# EAGLE design LAN_HUB_imp (EAGLE 6.4)
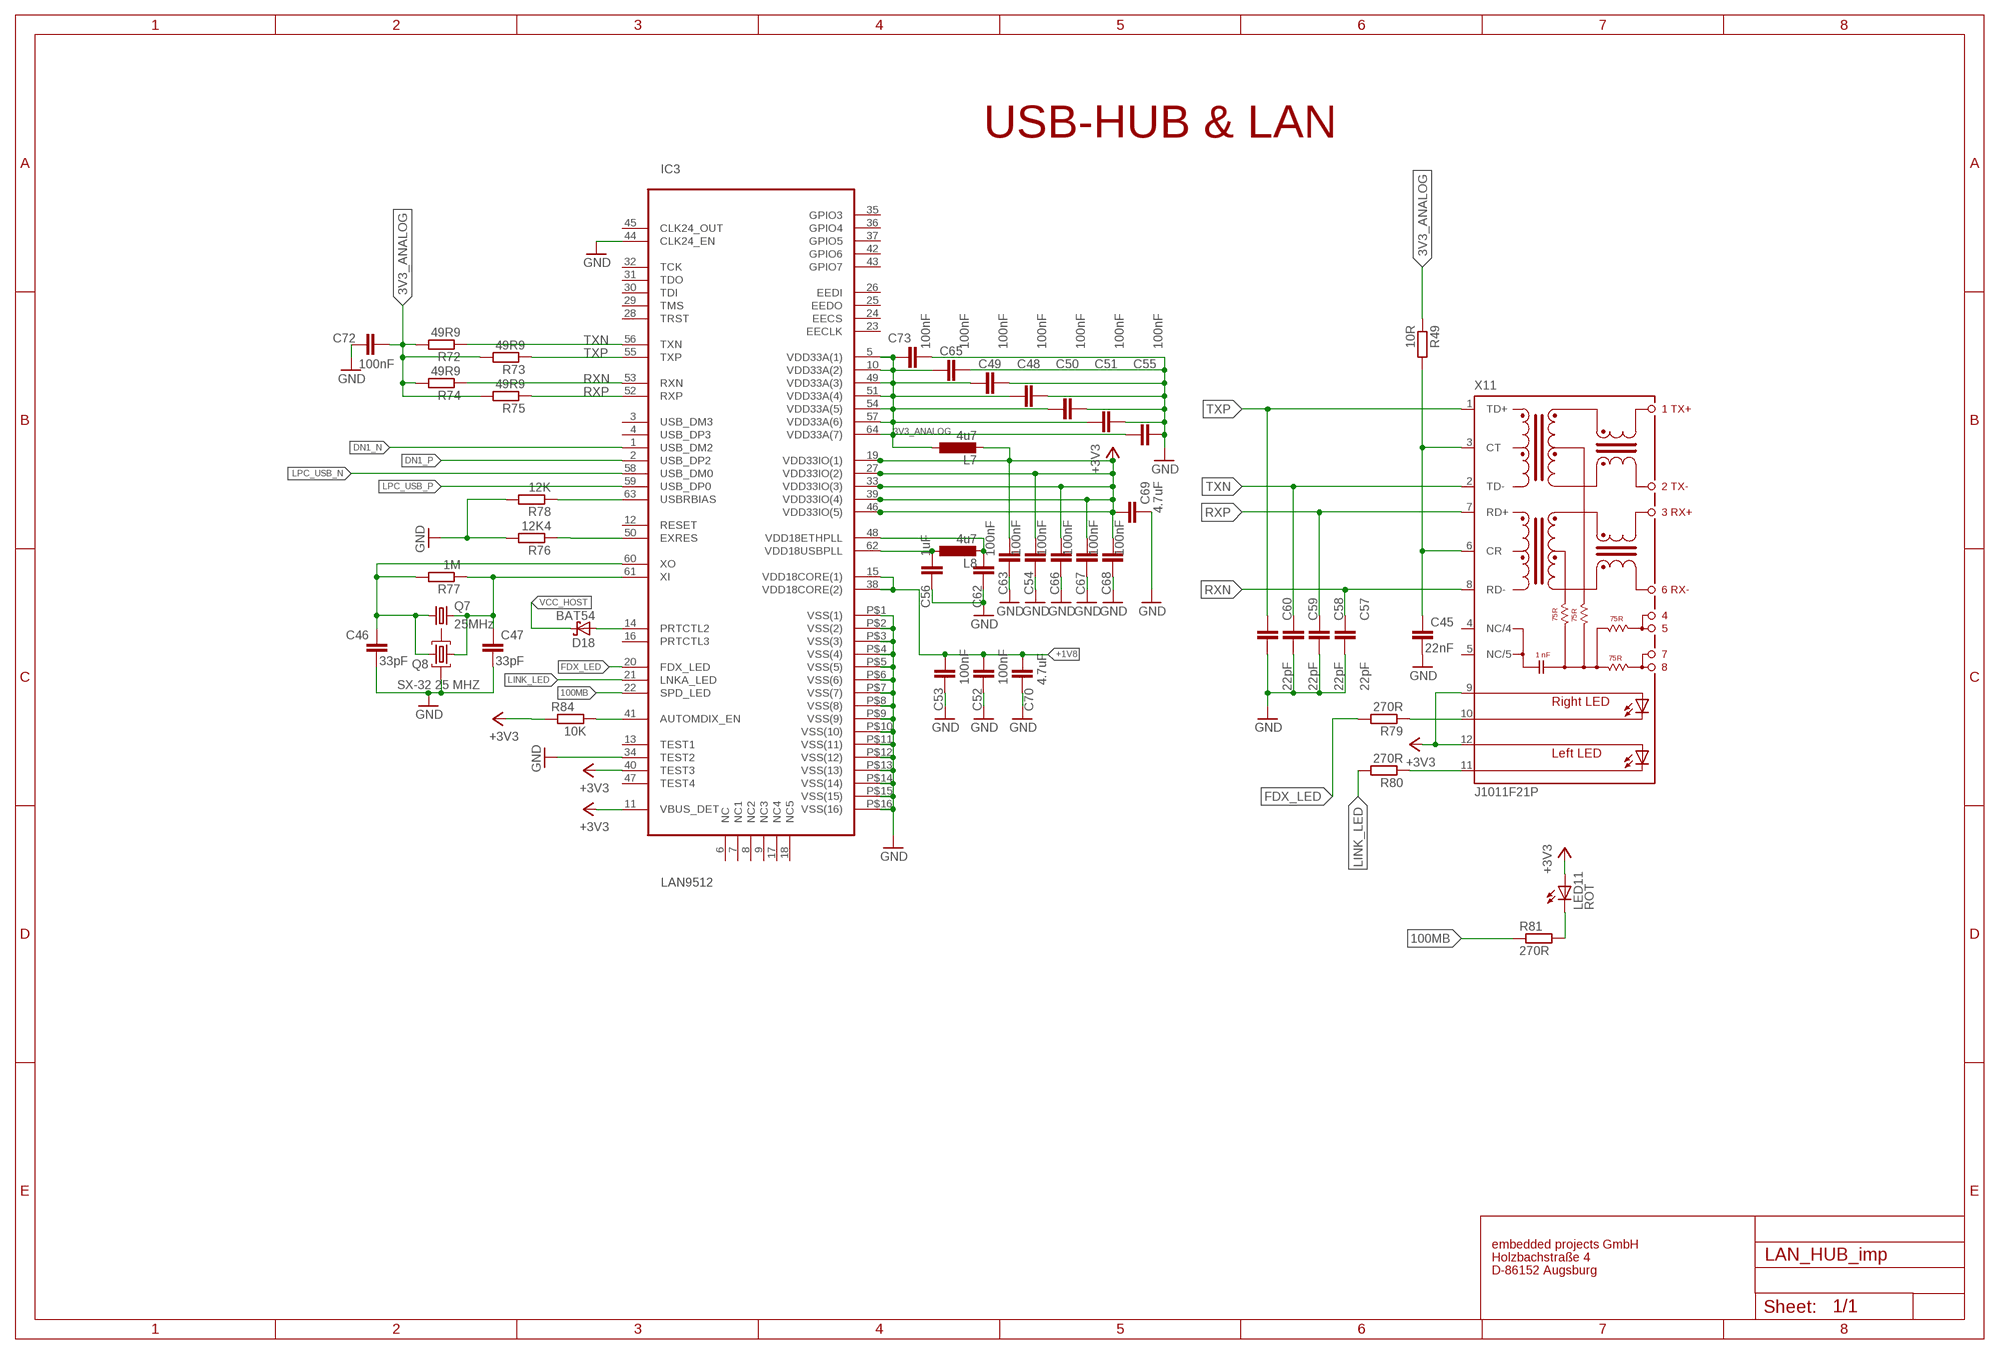
[diagram p0: schematic, sheet 1]

## Parts
C45  22nF  C-EUC0805  [C0805]
C46  33pF  C-EUC0805  [C0805]
C47  33pF  C-EUC0805  [C0805]
C48  100nF  C-EUC0805  [C0805]
C49  100nF  C-EUC0805  [C0805]
C50  100nF  C-EUC0805  [C0805]
C51  100nF  C-EUC0805  [C0805]
C52  100nF  C-EUC0805  [C0805]
C53  100nF  C-EUC0805  [C0805]
C54  100nF  C-EUC0805  [C0805]
C55  100nF  C-EUC0805  [C0805]
C56  1uF  C-EUC0805  [C0805]
C57  22pF  C-EUC0805  [C0805]
C58  22pF  C-EUC0805  [C0805]
C59  22pF  C-EUC0805  [C0805]
C60  22pF  C-EUC0805  [C0805]
C62  100nF  C-EUC0805  [C0805]
C63  100nF  C-EUC0805  [C0805]
C65  100nF  C-EUC0805  [C0805]
C66  100nF  C-EUC0805  [C0805]
C67  100nF  C-EUC0805  [C0805]
C68  100nF  C-EUC0805  [C0805]
C69  4.7uF  C-EUC0805  [C0805]
C70  4.7uF  C-EUC0805  [C0805]
C72  100nF  C-EUC0805  [C0805]
C73  100nF  C-EUC0805  [C0805]
D18  BAT54  DIODE_BAT54  [SOT-23]
IC3  LAN9512  [QFN-64]
L7  4u7  PSU3014  [PSU3014]
L8  4u7  PSU3014  [PSU3014]
LED11  ROT  LED_LEDCHIPLED_0805  [LED_CHIP-LED0805]
Q7  25MHz  CRYSTALHC49UP  [HC49UP]
Q8  SX-32 25 MHZ  SX-32  [SX-32]
R49  10R  R-EU_R0805  [R0805]
R72  49R9  R-EU_R0805  [R0805]
R73  49R9  R-EU_R0805  [R0805]
R74  49R9  R-EU_R0805  [R0805]
R75  49R9  R-EU_R0805  [R0805]
R76  12K4  R-EU_R0805  [R0805]
R77  1M  R-EU_R0805  [R0805]
R78  12K  R-EU_R0805  [R0805]
R79  270R  R-EU_R0805  [R0805]
R80  270R  R-EU_R0805  [R0805]
R81  270R  R-EU_R0805  [R0805]
R84  10K  R-EU_R0805  [R0805]
X11  J1011F21P  [J1]

## Nets
3V3_ANALOG: C48.2 C49.2 C50.2 C51.2 C55.2 C65.2 C72.1 C73.2 IC3.5(VDD33A(1)) IC3.10(VDD33A(2)) IC3.49(VDD33A(3)) IC3.51(VDD33A(4)) IC3.54(VDD33A(5)) IC3.57(VDD33A(6)) IC3.64(VDD33A(7)) L7.2 R49.1 R72.2 R73.2 R74.2 R75.2
100MB: IC3.22(SPD_LED) R81.1
+1V8: C52.2 C53.2 C70.1 IC3.15(VDD18CORE(1)) IC3.38(VDD18CORE(2))
+3V3: C54.2 C63.2 C66.2 C67.2 C68.2 C69.2 IC3.11(VBUS_DET) IC3.19(VDD33IO(1)) IC3.27(VDD33IO(2)) IC3.33(VDD33IO(3)) IC3.39(VDD33IO(4)) IC3.40(TEST3) IC3.46(VDD33IO(5)) L7.1 LED11.A R84.1 X11.9(A-R) X11.12(AL)
DN1_N: IC3.1(USB_DM2)
DN1_P: IC3.2(USB_DP2)
FDX_LED: IC3.20(FDX_LED) R79.2
GND: C45.1 C46.1 C47.1 C48.1 C49.1 C50.1 C51.1 C52.1 C53.1 C54.1 C55.1 C56.2 C57.1 C58.1 C59.1 C60.1 C62.2 C63.1 C65.1 C66.1 C67.1 C68.1 C69.1 C70.2 C72.2 C73.1 IC3.34(TEST2) IC3.44(CLK24_EN) IC3.P$1(VSS(1)) IC3.P$2(VSS(2)) IC3.P$3(VSS(3)) IC3.P$4(VSS(4)) IC3.P$5(VSS(5)) IC3.P$6(VSS(6)) IC3.P$7(VSS(7)) IC3.P$8(VSS(8)) IC3.P$9(VSS(9)) IC3.P$10(VSS(10)) IC3.P$11(VSS(11)) IC3.P$12(VSS(12)) IC3.P$13(VSS(13)) IC3.P$14(VSS(14)) IC3.P$15(VSS(15)) IC3.P$16(VSS(16)) Q8.2 R76.2 R78.2
LINK_LED: IC3.21(LNKA_LED) R80.2
LPC_USB_N: IC3.58(USB_DM0)
LPC_USB_P: IC3.59(USB_DP0)
N$10: C56.1 IC3.62(VDD18USBPLL) L8.2
N$11: LED11.C R81.2
N$21: C45.2 R49.2 X11.3(CT) X11.6(CR)
N$22: IC3.50(EXRES) R76.1
N$42: C62.1 IC3.48(VDD18ETHPLL) L8.1
N$61: C46.2 IC3.60(XO) Q7.1 Q8.3 R77.2
N$63: C47.2 IC3.61(XI) Q7.2 Q8.1 R77.1
N$65: IC3.63(USBRBIAS) R78.1
N$68: R79.1 X11.10(C-R)
N$76: R80.1 X11.11(C-L)
N$77: IC3.41(AUTOMDIX_EN) R84.2
N$78: D18.1(A) IC3.14(PRTCTL2)
RXN: C57.2 IC3.53(RXN) R74.1 X11.8(RD-)
RXP: C58.2 IC3.52(RXP) R75.1 X11.7(RD+)
TXN: C59.2 IC3.56(TXN) R72.1 X11.2(TD-)
TXP: C60.2 IC3.55(TXP) R73.1 X11.1(TD+)
VCC_HOST: D18.3(C)
Unconnected: IC3.3(USB_DM3) IC3.4(USB_DP3) IC3.6(NC) IC3.7(NC1) IC3.8(NC2) IC3.9(NC3) IC3.12(RESET) IC3.13(TEST1) IC3.16(PRTCTL3) IC3.17(NC4) IC3.18(NC5) IC3.23(EECLK) IC3.24(EECS) IC3.25(EEDO) IC3.26(EEDI) IC3.28(TRST) IC3.29(TMS) IC3.30(TDI) IC3.31(TDO) IC3.32(TCK) IC3.35(GPIO3) IC3.36(GPIO4) IC3.37(GPIO5) IC3.42(GPIO6) IC3.43(GPIO7) IC3.45(CLK24_OUT) IC3.47(TEST4) Q8.4 X11.4(NC/4) X11.5(NC/5)

## Notes on the sheet
- USB-HUB & LAN
- embedded projects GmbH
- Holzbachstraße 4
- D-86152 Augsburg

## Library data of the parts
C45-C60 C62 C63 C65-C70 C72 C73 = rcl:C-EU: CAPACITOR, European symbol
D18 = EmbeddedProjectsBauteile:DIODE_BAT54: Schottky Diodes Source: Fairchild .. BAT54.pdf; EP: 400113
IC3 = EmbeddedProjectsBauteile:LAN9512: USB 2.0 Hub and 10/100 Ethernet Controller; FARNELL: 2292586
L7 L8 = KUBUS3B_PARTS2:PSU3014: SMD Power Inductors Shielded
LED11 = EmbeddedProjectsBauteile:LED_LED
Q7 = crystal:CRYSTAL: CRYSTAL; OC_FARNELL: unknown; OC_NEWARK: unknown
Q8 = KUBUS3B_PARTS2:SX-32: SMD CRYSTAL; FARNELL: 1712841
R49 R72-R81 R84 = rcl:R-EU_: RESISTOR, European symbol
X11 = con-pulse:J1011F: PULSEJACK (TM) 1x1 Tab-UP RJ45 10/100 Base-TX RJ45 1x1 Tab-UP with LEDs 8-pin (J1 series) and 6-pin (JP series) integrated magnetics connector, designed to support applications, such as ADSL modems, LAN-on-Motherboard, and Hub and Switches. Source: www.pulseeng.com .. PulseJack-J402.pdf; OC_FARNELL: unknown; OC_NEWARK: unknown

## Net classes
0 default: clearance 0.15 mm
1 USB5V_EXT: width 0.15 mm, drill 0.3 mm, clearance 0.15 mm
2 5V: width 0.2 mm, clearance 0.15 mm
3 RELAY: width 1 mm, clearance 0.5 mm
5 0.15: width 0.125 mm, drill 0.3 mm, clearance 0.15 mm

## Board
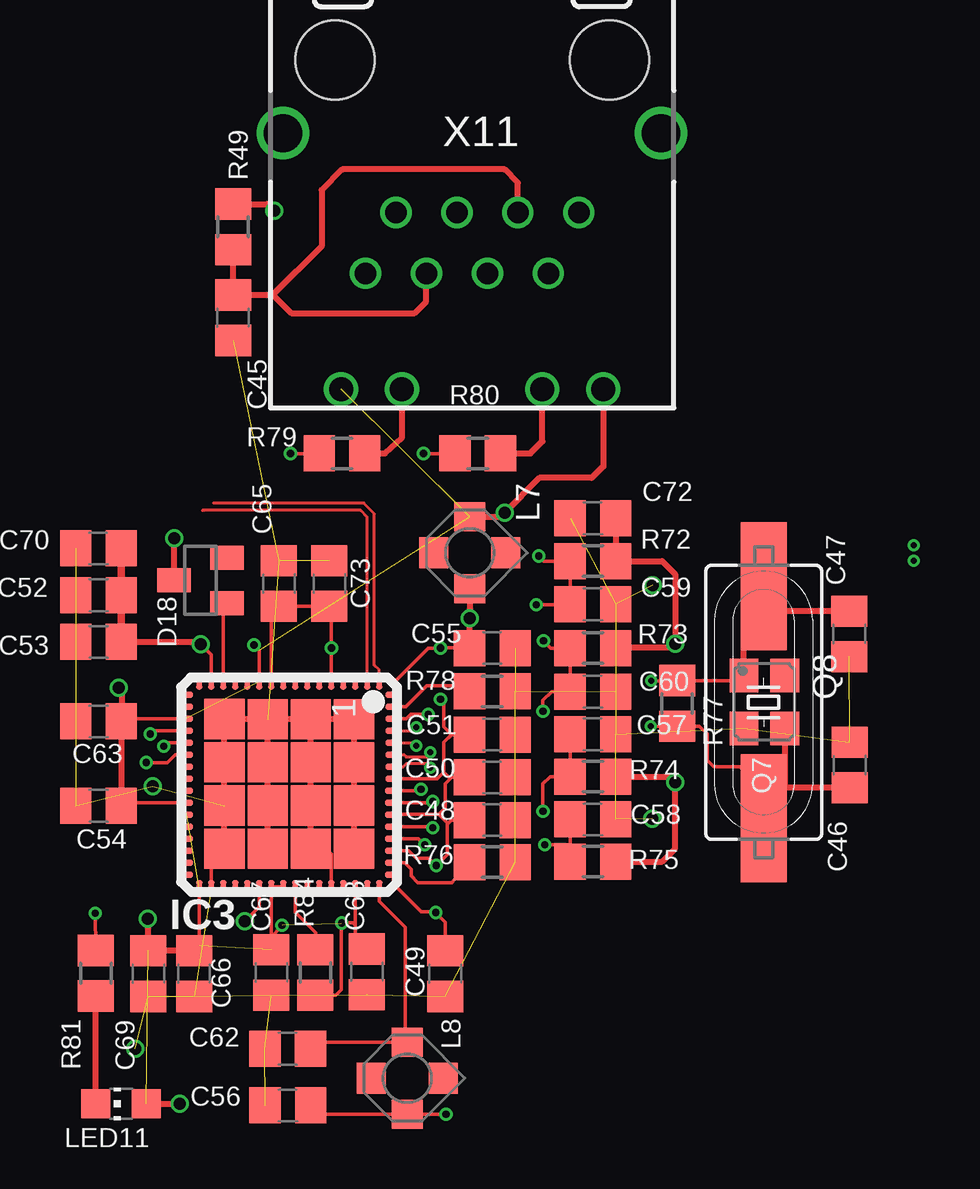
[diagram p1: board, top side]
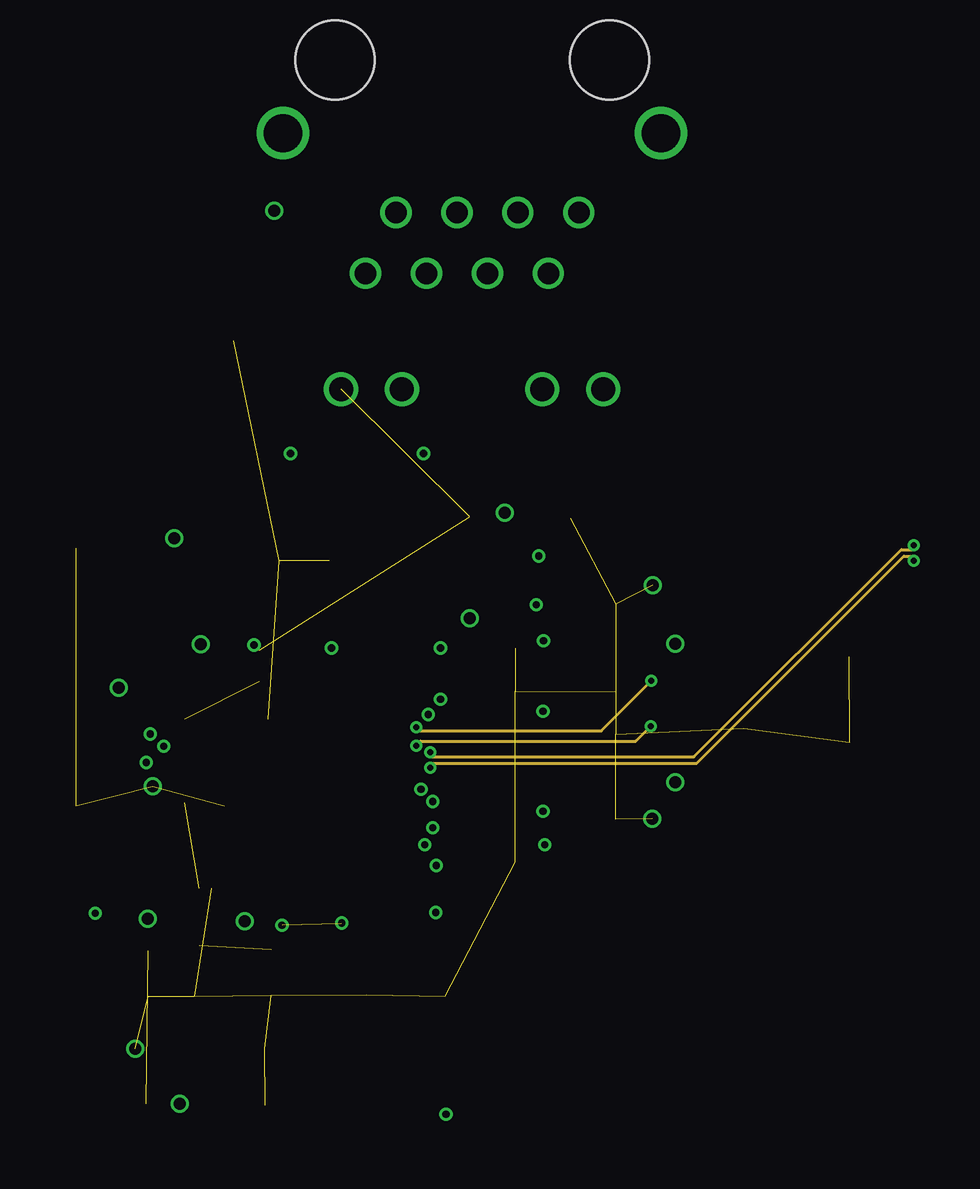
[diagram p2: board, inner layer Route2]
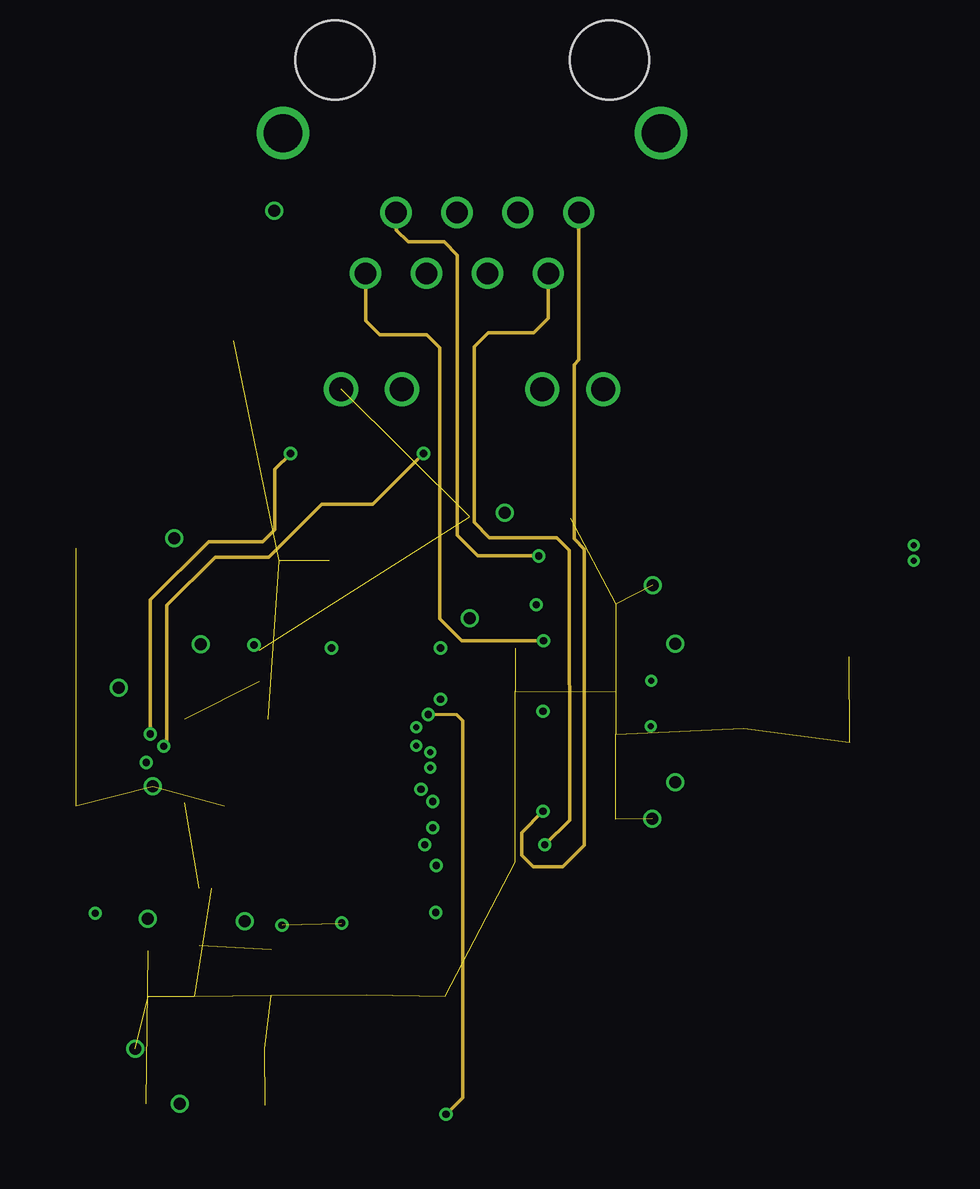
[diagram p3: board, inner layer Route15]
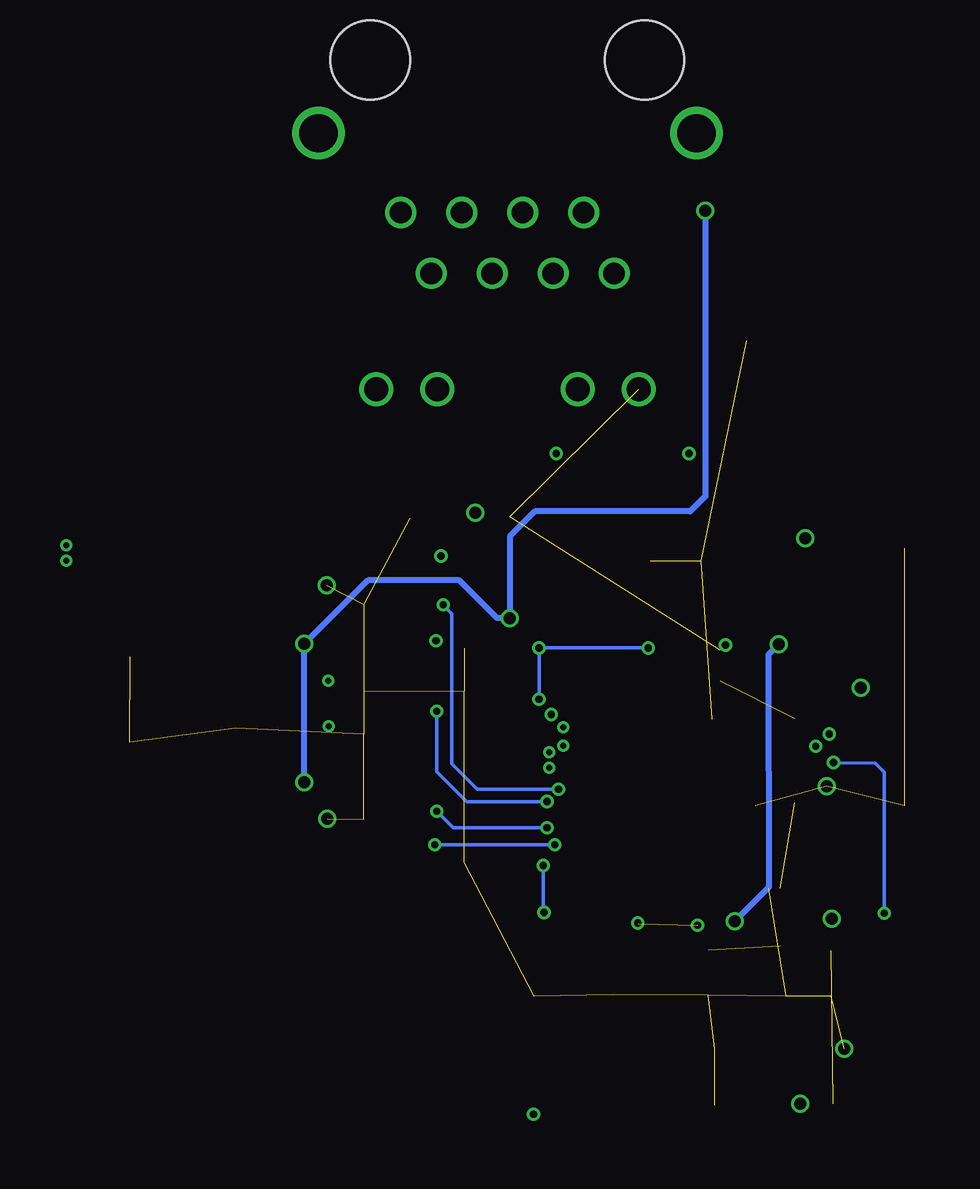
[diagram p4: board, bottom side, seen from below]

No outline drawn. Coordinates in mm, seen from the top.
Copper layers (1*2+15*16): Top 0.012mm / dielectric 0.36mm / Route2 0.018mm / dielectric 0.71mm / Route15 0.035mm / dielectric 0.2mm / Bottom 0.012mm
Design rules "125um_0.2mmborhung_4Layer *": minimum track width 0.125mm, minimum drill 0.25mm, track to track 0.125mm, track to pad 0.125mm, pad to pad 0.125mm, via to via 0.125mm, smd to smd 0mil, copper to edge 0.45mm, drill to drill 0.3mm, minimum pad ring 0.125mm, minimum via ring 0.125mm, stop-mask expansion 0.1mm, vias tented up to drill 40mil, thermal gap 0.2mm

### Footprints (pad centres in the part's own frame; a part is rotated, then mirrored left to right if it is on the bottom)
C0805 = smd 1.3 x 1.5: 1 -0.95,0; 2 0.95,0
SOT-23 = smd 1 x 1.4: 1 -0.95,-1.1; 2 0.95,-1.1; 3 0,1.1
QFN-64 = smd 0.27 x 0.7: 1 0.98,0.42; 2 1.48,0.42; 3 1.98,0.42; 4 2.48,0.42; 5 2.98,0.42; 6 3.48,0.42; 7 3.98,0.42; 8 4.48,0.42; 9 4.98,0.42; 10 5.48,0.42; 11 5.98,0.42; 12 6.48,0.42; 13 6.98,0.42; 14 7.48,0.42; 15 7.98,0.42; 16 8.48,0.42; 33 8.48,9.05; 34 7.98,9.05; 35 7.48,9.05; 36 6.98,9.05; 37 6.48,9.05; 38 5.98,9.05; 39 5.48,9.05; 40 4.98,9.05; 41 4.48,9.05; 42 3.98,9.05; 43 3.48,9.05; 44 2.98,9.05; 45 2.48,9.05; 46 1.98,9.05; 47 1.48,9.05; 48 0.98,9.05 | smd 0.7 x 0.27: 17 9.08,0.98; 18 9.08,1.48; 19 9.08,1.98; 20 9.08,2.48; 21 9.08,2.98; 22 9.08,3.48; 23 9.08,3.98; 24 9.08,4.48; 25 9.08,6.48; 26 9.08,5.98; 27 9.08,5.48; 28 9.08,4.98; 29 9.08,6.98; 30 9.08,7.48; 31 9.08,7.98; 32 9.08,8.48; 49 0.39,8.48; 50 0.39,7.98; 51 0.39,7.48; 52 0.39,6.98; 53 0.39,6.48; 54 0.39,5.98; 55 0.39,5.48; 56 0.39,4.98; 57 0.38,4.48; 58 0.38,3.98; 59 0.38,3.48; 60 0.38,2.98; 61 0.38,2.48; 62 0.38,1.98; 63 0.38,1.48; 64 0.38,0.98 | smd 1.676 x 1.676: P$1 2.03,2; P$2 3.83,2; P$3 5.63,2; P$4 7.43,1.99; P$5 7.43,3.8; P$6 5.63,3.8; P$7 3.83,3.8; P$8 2.03,3.8; P$9 2.03,5.6; P$10 3.83,5.6; P$11 5.63,5.6; P$12 7.43,5.6; P$13 7.43,7.4; P$14 5.63,7.4; P$15 3.83,7.4; P$16 2.03,7.4
PSU3014 = smd 1.2 x 1.3: 1 -1.5,0; 2 1.5,0 | smd 1.3 x 1.2: 3 0,1.5; 4 0,-1.5
LED_CHIP-LED0805 = smd 1.2 x 1.2: A 0,-1.05; C 0,1.05
HC49UP = smd 5.334 x 1.93: 1 -4.826,0; 2 4.826,0
SX-32 = smd 1.4 x 1.2: 1 -1.1,-0.85; 2 1.1,-0.85; 3 1.1,0.85; 4 -1.1,0.85
R0805 = smd 1.3 x 1.5: 1 -0.95,0; 2 0.95,0
J1 = drill 0.9 pad 1.3: 1 4.445,2.54; 2 3.175,0; 3 1.905,2.54; 4 0.635,0; 5 -0.635,2.54; 6 -1.905,0; 7 -3.175,2.54; 8 -4.445,0 | drill 1 pad 1.422: 9 5.465,7.37; 10 2.925,7.37; 11 -2.925,7.37; 12 -5.465,7.37 | drill 1.6 pad 2.184: M1 -7.875,-3.3; M2 7.875,-3.3 | hole 3.3: 5.715,-6.35; -5.715,-6.35

### Placement (x,y rotation side)
C45  8.35,50.03 90 top
C46  34.04,31.39 270 top
C47  34.02,36.85 90 top
C48  19.15,29.1 180 top
C49  17.19,22.7 90 top
C50  19.15,30.88 180 top
C51  19.15,32.66 180 top
C52  2.74,38.47 0 top
C53  2.74,36.52 0 top
C54  2.74,29.7 0 top
C55  19.15,36.27 180 top
C56  10.63,17.21 180 top
C57  23.34,32.68 180 top
C58  23.34,29.13 180 top
C59  23.34,38.09 180 top
C60  23.34,34.45 180 top
C62  10.62,19.57 180 top
C63  2.74,33.21 0 top
C65  10.26,38.96 270 top
C66  6.72,22.7 90 top
C67  9.94,22.75 90 top
C68  13.92,22.78 90 top
C69  4.82,22.7 90 top
C70  2.74,40.42 180 top
C72  23.34,41.68 180 top
C73  12.36,38.96 270 top
D18  6.99,39.09 90 top
IC3  15.42,35.31 180 top
L7  18.21,40.23 270 top
L8  15.61,18.35 270 top
LED11  3.68,17.28 90 top
Q7  30.46,34.01 90 top
Q8  30.48,34.02 270 top
R49  8.35,53.82 270 top
R72  23.34,39.89 0 top
R73  23.34,36.27 0 top
R74  23.34,30.91 0 top
R75  23.34,27.37 0 top
R76  19.15,27.35 0 top
R77  26.85,33.96 270 top
R78  19.15,34.46 0 top
R79  12.89,44.38 180 top
R80  18.54,44.38 180 top
R81  2.63,22.72 270 top
R84  11.77,22.75 90 top
X11  18.31,54.42 180 top

### Tracks (layer width: path | path; a pad name or v marks a point on that pad's centre or on a via)
3V3_ANALOG  (via drill 0.3, 0.5)
  Top 0.15: C48.2 17.44,29.1 17.27,28.93 | 17.27,28.93 17.27,27.66 16.89,27.28 v16.82,27.2 16.51,27.51 15.98,27.51 15.67,27.81 15.04,27.81 IC3.51 | C50.2 17.47,30.88 | 17.47,30.88 17.2,30.61 17.2,29.62 16.92,29.34 | 16.92,29.34 IC3.54 | C51.2 17.45,32.66 17.12,32.33 | 17.12,32.33 17.12,31.09 | 17.12,31.09 16.86,30.83 IC3.57 | IC3.49 15.03,26.45 16.18,25.27 16.76,25.27 v16.79,25.25 17.2,24.84 C49.2 | 17.27,28.93 17.27,28.98 16.92,29.34 | 17.47,30.88 17.33,30.88 17.12,31.09 | IC3.64 15.06,34.35 15.06,34.85 16.48,36.27 v16.99,36.27 C55.2 | 17.12,32.33 17.45,32.66 17.12,32.99 17.12,34.01 v16.99,34.14 | IC3.5 12.44,36.26 v12.45,36.27 12.44,36.3 12.44,37.93 C73.2 12.34,38.01 C65.2 9.94,37.74 IC3.10
  Top 0.254: R75.2 26.23,27.37 26.77,27.91 26.77,30.63 v26.77,30.68 26.55,30.91 R74.2 | R73.2 26.59,36.27 v26.77,36.45 26.77,39.34 26.23,39.89 R72.2 C72.1 | C55.2 18.2,37.5 v18.21,37.52 18.21,37.54 L7.2 | R49.1 9.77,54.77 v10.06,54.48
  Bottom 0.15: v16.99,34.14 v16.99,36.27 16.23,36.27 v12.45,36.27 | v16.82,27.2 16.82,25.27 v16.79,25.25
  Bottom 0.254: v26.77,30.68 v26.77,36.45 24.13,39.09 20.32,39.09 18.74,37.52 v18.21,37.52 18.21,40.92 17.17,41.96 10.69,41.96 10.06,42.6 v10.06,54.48
100MB  (via drill 0.3)
  Top 0.15: IC3.22 5.94,31.83 5.61,31.5 v4.72,31.5 | v2.61,25.22 2.63,23.72 R81.1
  Bottom 0.15: v4.72,31.5 2.99,31.48 2.61,31.09 v2.61,25.22
+1V8  (via drill 0.5)
  Top 0.15: IC3.38 9.44,25.49 v8.84,24.89 | IC3.15 7.44,36 v7.01,36.42
  Top 0.254: C53.2 6.91,36.52 v7.01,36.42
  Top 0.305: C70.1 C52.2 C53.2
  Bottom 0.254: v7.01,36.42 7.44,35.99 7.42,26.31 v8.84,24.89
+3V3  (via drill 0.3, 0.5)  (7 unrouted)
  Top 0.15: IC3.19 3.73,33.33 C63.2 | IC3.27 3.74,29.83 C54.2 | IC3.33 6.94,23.87 C66.2 | IC3.39 9.94,24.21 | 9.94,24.21 9.94,23.68 C67.2 | IC3.46 13.44,24.71 | 13.44,24.71 13.44,24.21 C68.2 | IC3.11 9.44,36.18 v9.22,36.4 | v10.39,24.71 10.34,24.66 9.94,24.21 | 13.44,24.71 13.34,24.82 v12.88,24.82 12.85,24.79 12.85,22.02 12.63,21.8 R84.1
  Top 0.254: LED11.A 6,17.28 v6.12,17.28 | L7.1 19.48,41.73 v19.66,41.91 21.11,43.36 23.29,43.36 23.77,43.84 X11.12 | 3.73,33.33 3.73,34.48 v3.58,34.62 | C63.2 C54.2 | v4.8,24.99 4.82,24.97 C69.2 C66.2 | IC3.40 IC3.39
DN1_N
  Top 0.125: IC3.1 14.44,35.37 14.24,35.56 14.24,41.86 13.8,42.3 7.57,42.3 7.53,42.3
DN1_P
  Top 0.125: IC3.2 13.94,41.72 13.66,42 7.14,42 7.07,42
FDX_LED  (via drill 0.3)
  Top 0.15: IC3.20 5.04,32.83 v4.9,32.69 | R79.2 | v10.74,44.37 R79.2
  Route15 0.15: v4.9,32.69 4.9,38.28 7.34,40.69 9.58,40.69 10.08,41.2 10.08,43.71 v10.74,44.37
GND  (via drill 0.5)  (33 unrouted)
  Top 0.15: IC3.44 12.44,27.69 IC3.P$15 | IC3.34 7.44,27.36 IC3.P$13
  Top 0.254: IC3.P$16 IC3.P$9 IC3.P$8 IC3.P$1 IC3.P$2 | IC3.P$15 IC3.P$10 IC3.P$7 IC3.P$2 | IC3.P$14 IC3.P$11 IC3.P$6 IC3.P$3 | IC3.P$13 IC3.P$12 IC3.P$5 IC3.P$4 8,33.31 IC3.P$3 | IC3.P$2 IC3.P$3
  other vias: 25.84,38.89 25.81,29.16 4.27,19.58 5,30.5
LINK_LED  (via drill 0.3)
  Top 0.15: IC3.21 5.61,32.33 v5.46,32.18 | v16.28,44.37 17.97,44.37 R80.2
  Route15 0.15: v5.46,32.18 5.59,32.33 5.59,38.05 7.59,40.06 9.83,40.06 12.04,42.27 14.17,42.27 v16.28,44.37
LPC_USB_N  (via drill 0.25)
  Top 0.125: IC3.58 15.45,31.33 15.58,31.46 16.56,31.46 v16.56,31.27 | 36.7,40.1 v36.7,39.91
  Route2 0.125: v16.56,31.27 16.56,31.46 27.67,31.46 36.3,40.1 36.7,40.1 v36.7,39.91
LPC_USB_P  (via drill 0.25)
  Top 0.125: IC3.59 15.47,31.83 15.56,31.73 16.56,31.73 v16.56,31.92 | 36.7,40.37 v36.7,40.56
  Route2 0.125: v16.56,31.92 16.56,31.73 27.55,31.73 36.19,40.37 36.7,40.37 v36.7,40.56
N$10  (via drill 0.3)
  Top 0.15: IC3.62 15.57,33.33 15.75,33.5 v16.48,33.5 | v17.22,16.84 15.51,16.84 | 15.51,16.84 L8.2 | 15.51,16.84 11.95,16.84 C56.1
  Route15 0.15: v16.48,33.5 17.66,33.48 17.92,33.23 17.92,17.54 v17.22,16.84
N$11
  Top 0.254: LED11.C R81.2
N$21
  Top 0.254: R49.2 C45.2 10.01,50.98 | 10.01,50.98 10.78,50.22 15.91,50.22 16.39,50.7 16.4,51.74 X11.3 | X11.6 20.21,55.66 19.66,56.21 12.9,56.21 12.04,55.35 12.04,53 10.01,50.98
N$22
  Top 0.15: 17.93,27.33 R76.1 18.19,27.34 17.7,26.77 17.45,26.49 16.05,26.49 15.77,26.77 15.77,27.05 15.5,27.33 IC3.50
N$42
  Top 0.15: IC3.48 14.44,25.72 15.52,24.64 15.52,19.86 L8.1 11.7,19.84 C62.1
N$61  (via drill 0.25)
  Top 0.125: IC3.60 15.91,32.33 v15.98,32.21 | v25.76,33.02 26.67,33.02 R77.2
  Top 0.15: R77.2 27.77,33.01 28.1,32.69 28.1,31.6 28.38,31.32 29.46,31.32 30.45,30.33 Q7.1
  Top 0.254: C46.2 31.34,30.44 | 31.34,30.44 30.57,30.44 30.45,30.33 | Q8.3 31.33,30.45 31.34,30.44
  Route2 0.125: v15.98,32.21 16.15,32.38 25.12,32.38 v25.76,33.02
N$63  (via drill 0.25)
  Top 0.125: IC3.61 15.83,32.83 v15.98,32.97 | v25.78,34.9 26.66,34.9 R77.1
  Top 0.15: R77.1 29.43,34.91 Q8.1
  Top 0.254: Q8.1 29.63,37.8 | 29.63,37.8 29.63,38.01 Q7.2 | C47.2 29.64,37.8 29.63,37.8
  Route2 0.125: v15.98,32.97 16.1,32.82 23.7,32.82 v25.78,34.9
N$65
  Top 0.15: IC3.63 15.54,33.83 16.41,34.7 18.01,34.7 R78.1
N$68
  Top 0.254: R79.1 14.69,44.38 15.39,45.03 15.39,47.04 X11.10
N$76
  Top 0.254: R80.1 20.73,44.38 21.23,44.88 X11.11
N$77
  Top 0.15: IC3.41 10.94,25.26 11.79,24.41 11.79,23.66 R84.2
N$78
  Top 0.15: IC3.14 7.94,37.97 D18.1
RXN  (via drill 0.3)
  Top 0.15: IC3.53 16.61,28.83 v16.66,28.78 | v21.26,29.46 21.26,30.61 21.57,30.91 R74.1 C57.2
  Route15 0.15: X11.8 22.75,48.28 22.55,48.08 22.55,40.82 22.98,40.39 22.98,28.06 22.09,27.15 20.85,27.15 20.37,27.64 20.37,28.57 v21.26,29.46
  Bottom 0.15: v16.66,28.78 20.57,28.78 v21.26,29.46
RXP  (via drill 0.3)
  Top 0.15: IC3.52 16.07,28.33 v16.33,28.07 | v21.34,28.07 22.38,28.07 22.39,28.03 | 22.39,28.03 R75.1 | C58.2 22.39,28.49 22.39,28.03
  Route15 0.15: X11.7 21.48,50.01 20.88,49.4 18.97,49.4 18.39,48.82 18.39,41.5 19.02,40.87 21.83,40.87 22.36,40.34 22.37,29.1 v21.34,28.07
  Bottom 0.15: v16.33,28.07 v21.34,28.07
TXN  (via drill 0.3)
  Top 0.15: IC3.56 16.13,30.33 v16.18,30.38 | v20.98,38.08 22.38,38.08 C59.2 R72.1 21.3,39.89 v21.08,40.11
  Route15 0.15: v21.08,40.11 18.54,40.11 17.68,40.97 17.68,52.63 17.14,53.19 15.65,53.19 15.14,53.67 X11.2
  Bottom 0.15: v16.18,30.38 19.56,30.38 20.62,31.45 20.62,37.69 v20.98,38.08
TXP  (via drill 0.3)
  Top 0.15: IC3.55 16.62,29.83 v16.66,29.87 | v21.26,33.63 21.26,34.09 21.61,34.44 C60.2 R73.1 21.59,36.27 v21.29,36.58
  Route15 0.15: v21.29,36.58 17.88,36.58 16.97,37.49 16.97,48.78 16.96,48.78 16.41,49.33 14.45,49.33 13.87,49.91 X11.1
  Bottom 0.15: v16.66,29.87 20.02,29.87 21.26,31.11 v21.26,33.63
VCC_HOST  (via drill 0.5)
  Top 0.254: D18.3 5.89,40.83 v5.89,40.84

### Text on the board
tStop: 7